# EasyEDA schematic Brake_Schematic.json
TITLE: Sheet_1; REV: 1.0; Date: 2024-07-30; Sheet: 1/1; Drawn By: ekhan; Company: Your Company
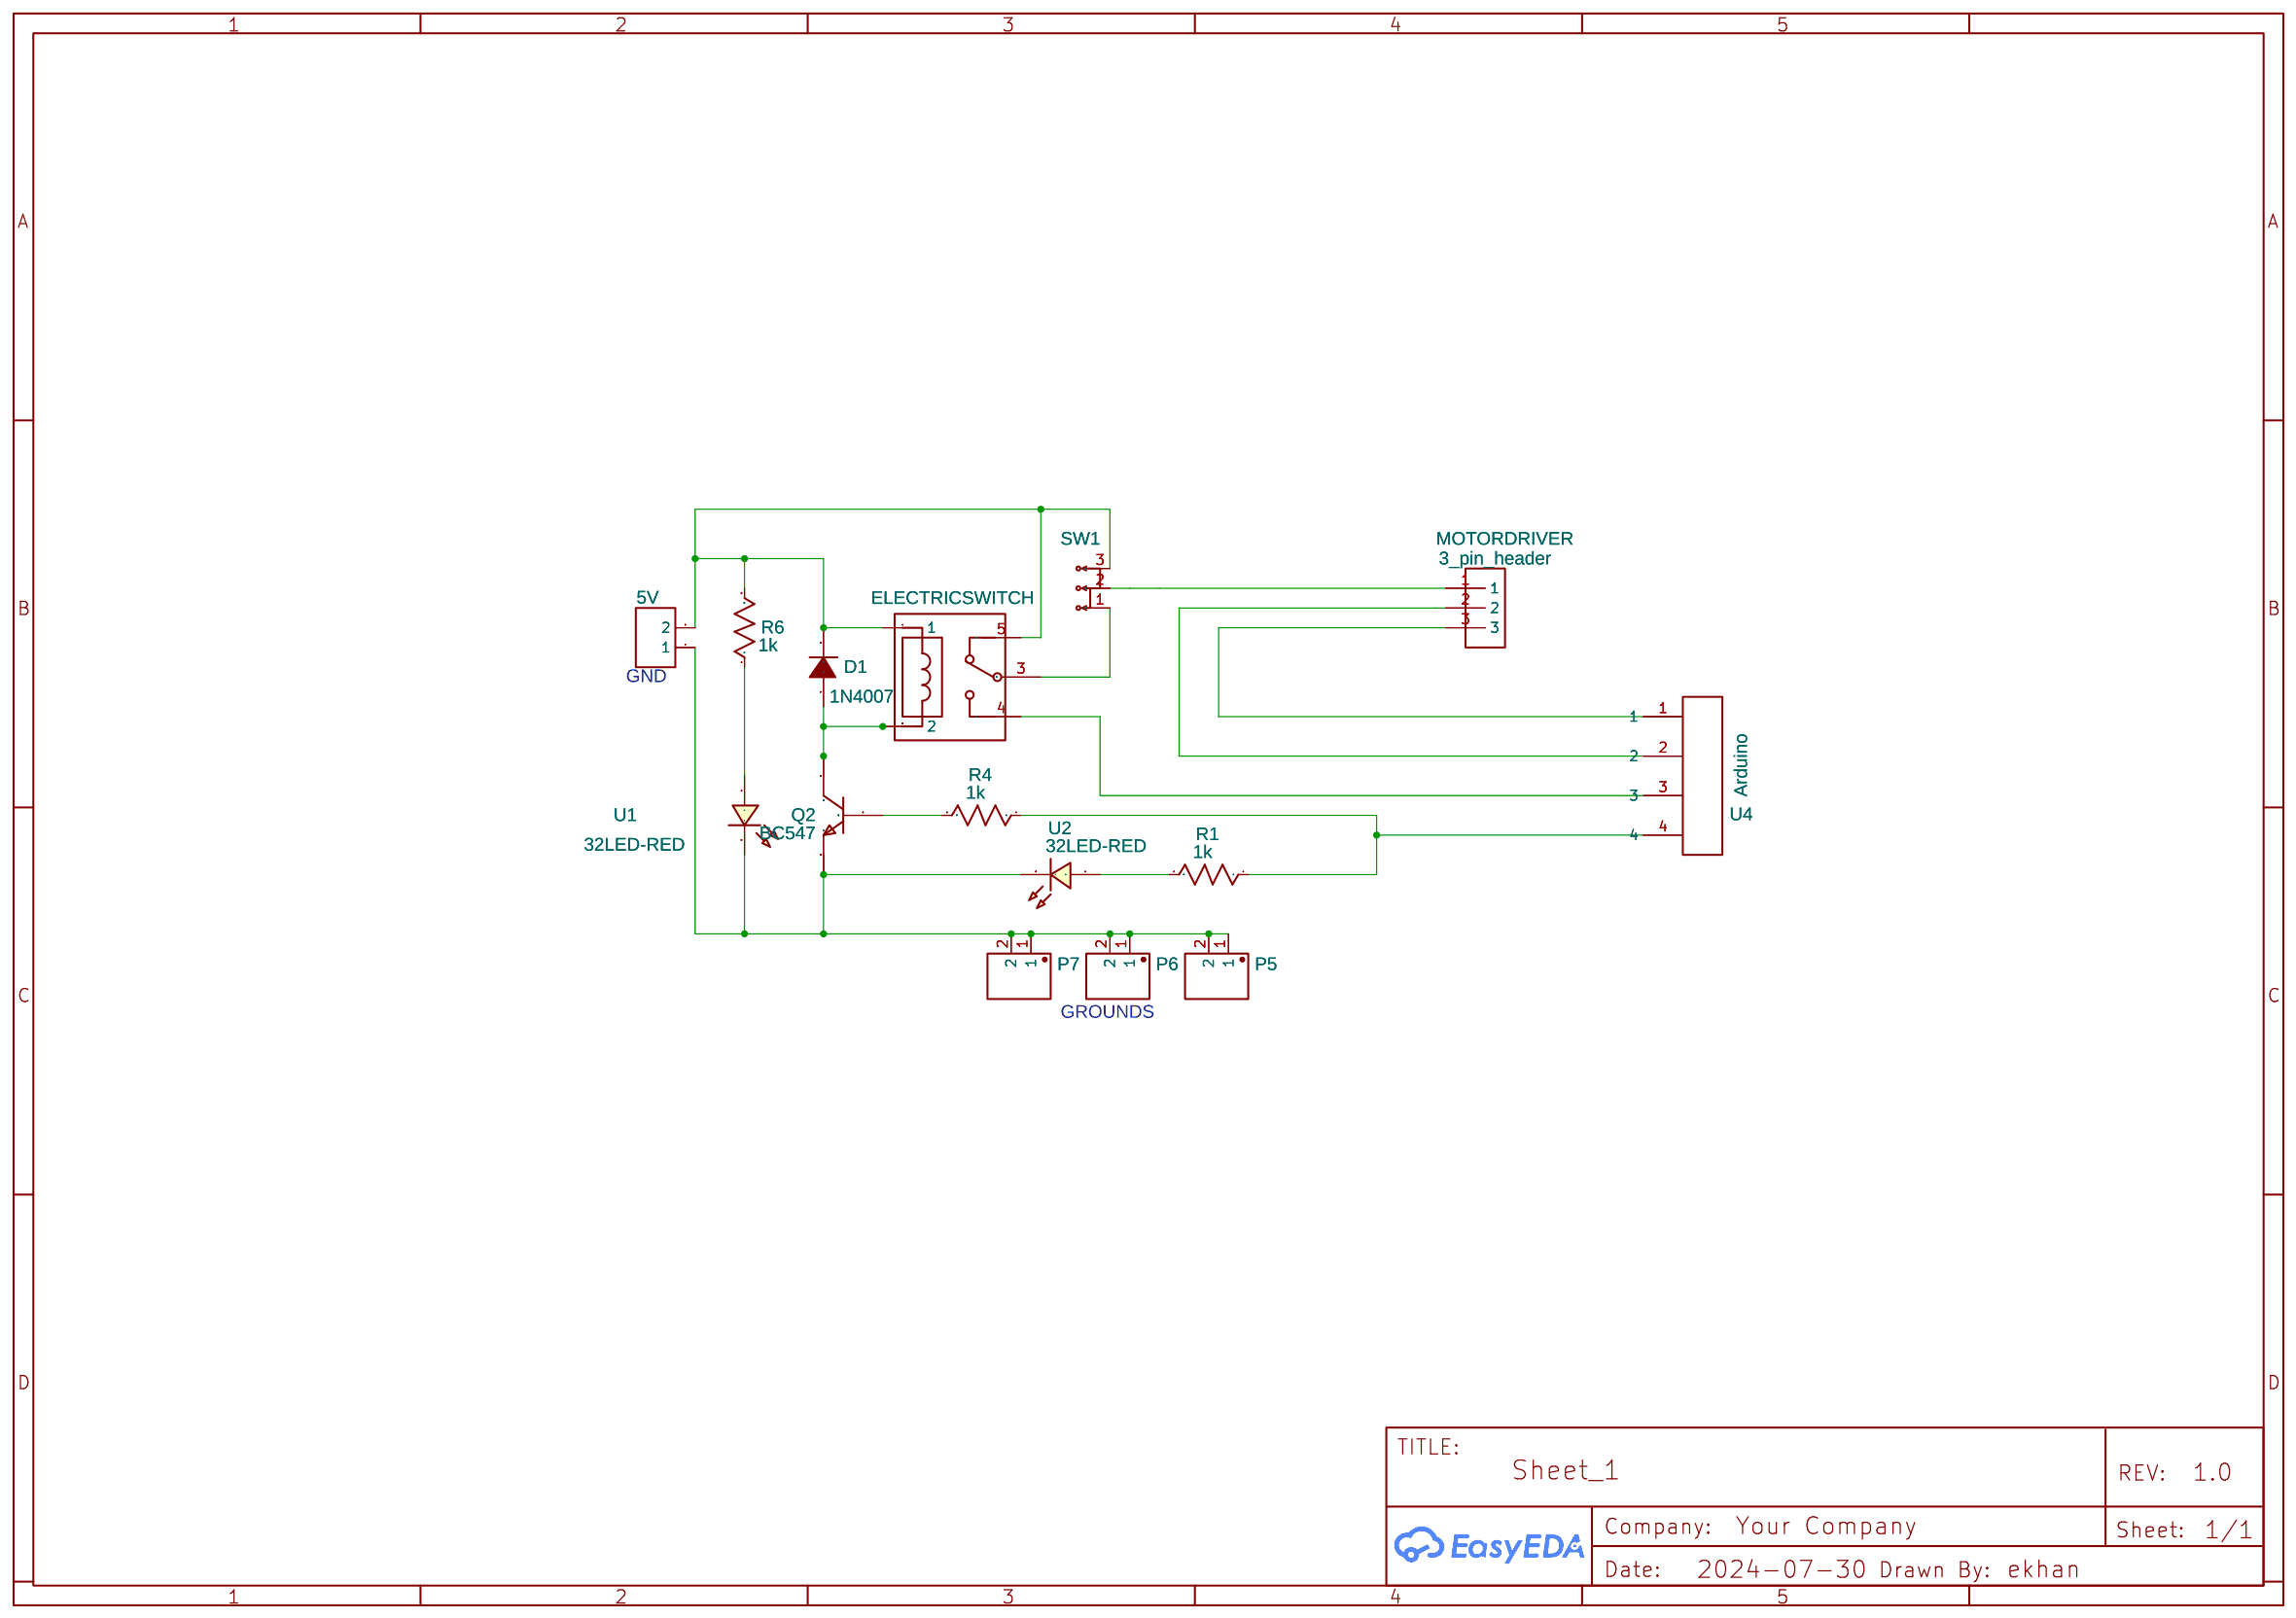
[diagram p0: schematic sheet]

## Parts
5V  200mils 2pin Header  [100MILS 2PIN HEADER]
D1  1N4007  [DO-41_BD2.4-L4.7-P8.70-D0.9-RD]
ELECTRICSWITCH  HRS4H-S-5v  [HRS4H-S-5V]
MOTORDRIVER  3_pin_header  [3PIN HEADER]
P5  TERMINAL2P_H  [100MILS 2PIN HEADER]
P6  TERMINAL2P_H  [100MILS 2PIN HEADER]
P7  TERMINAL2P_H  [100MILS 2PIN HEADER]
Q2  BC547  [BC547]
R1  1k  [R_AXIAL-0.3]
R4  1k  [R_AXIAL-0.3]
R6  1k  [R_AXIAL-0.3]
SW1  SS12D00G3  [SW-TH_SS-12D01-GX]
U1  32LED-RED  [LED-TH_L5..8-W5.6-P2.54_32LED-RED]
U2  32LED-RED  [LED-TH_L5..8-W5.6-P2.54_32LED-RED]
U4  Arduino  [4_PIN_HEADER_100MILS]

## Library data of the parts
5V = 200mils 2pin Header: Contributor: zeeshan_nafees_ahmed_hu
D1 = 1N4007: Supplier: LCSC; Manufacturer: ST(先科); Supplier Part: C106903; JLCPCB Part Class: Extended Part
ELECTRICSWITCH = HRS4H-S-5v: Supplier: LCSC; Supplier Part: C559408; link: https://atta.szlcsc.comnull; Contributor: test0071
MOTORDRIVER = 3_pin_header: catid: 20; Contributor: Argulab; sim: true
P5-P7 = TERMINAL2P_H: Supplier: LCSC; Manufacturer: BOOMELE; Manufacturer Part: CH5.08-2A; image: //image.lceda.cn/szlcsc/C27692.jpg; Supplier Part: C27692; Contributor: Dang Hung
Q2 = BC547: Contributor: Suraj Prabhakaran
R1 R4 R6 = R_AXIAL-0.3_US: Contributor: LCEDA_Lib
SW1 = SS12D00G3: Contributor: lcsc; Supplier: LCSC; Supplier Part: C9900018735; Manufacturer: null; JLCPCB Part Class: Extended Part
U1 U2 = 32LED-RED: Supplier: LCSC; Supplier Part: C3306983; Manufacturer: Grayhill; JLCPCB Part Class: Extended Part; Contributor: lcsc
U4 = 200mils_4Pin_Header: Contributor: zeeshan_nafees_ahmed_hu

## Nets
Net-(5V-1): 5V.1 P5.1 P5.2 P6.1 P6.2 P7.1 P7.2 Q2.3(E) U1.2(-) U2.2(-)
Net-(5V-2): 5V.2 D1.1(K) ELECTRICSWITCH.1 ELECTRICSWITCH.5 R6.2 SW1.3
Net-(D1-2): D1.2(A) ELECTRICSWITCH.2 Q2.1(C)
Net-(ELECTRICSWITCH-3): ELECTRICSWITCH.3 SW1.1
Net-(ELECTRICSWITCH-4): ELECTRICSWITCH.4 U4.3
Net-(MOTORDRIVER-1): MOTORDRIVER.1 SW1.2
Net-(MOTORDRIVER-2): MOTORDRIVER.2 U4.2
Net-(MOTORDRIVER-3): MOTORDRIVER.3 U4.1
Net-(Q2-2): Q2.2(B) R4.2
Net-(R1-1): R1.1 R4.1 U4.4
Net-(R1-2): R1.2 U2.1(+)
Net-(R6-1): R6.1 U1.1(+)

## Notes on the sheet
- GND
- GROUNDS
